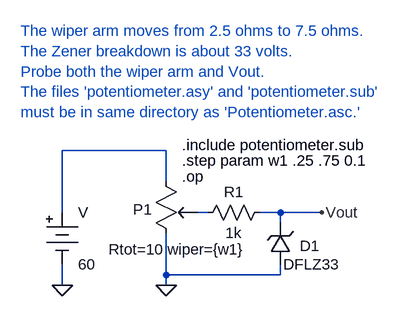
[diagram p0: schematic Zener.asc]
Zener.asc, the LTspice schematic file:
Version 4
SHEET 1 2024 848
WIRE -432 -560 -592 -560
WIRE -432 -512 -432 -560
WIRE -592 -464 -592 -560
WIRE -368 -464 -384 -464
WIRE -256 -464 -288 -464
WIRE -192 -464 -256 -464
WIRE -256 -448 -256 -464
WIRE -432 -368 -432 -432
WIRE -256 -368 -256 -384
WIRE -256 -368 -432 -368
WIRE -592 -352 -592 -384
WIRE -432 -352 -432 -368
FLAG -432 -352 0
FLAG -592 -352 0
FLAG -192 -464 Vout
SYMBOL Misc\\battery -592 -480 R0
WINDOW 123 0 0 Left 0
WINDOW 39 0 0 Left 0
SYMATTR InstName V
SYMATTR Value 60
SYMBOL potentiometer -448 -528 R0
WINDOW 3 -73 121 Left 0
WINDOW 0 -35 59 Left 0
SYMATTR Value Rtot=10 wiper={w1}
SYMATTR InstName P1
SYMBOL zener -240 -384 R180
WINDOW 0 -45 29 Left 0
WINDOW 3 -76 0 Left 0
SYMATTR InstName D1
SYMATTR Value DFLZ33
SYMBOL res -272 -480 R90
WINDOW 0 0 56 VBottom 0
WINDOW 3 32 56 VTop 0
SYMATTR InstName R1
SYMATTR Value 1k
TEXT -408 -568 Left 0 !.include potentiometer.sub
TEXT -408 -544 Left 0 !.step param w1 .25 .75 0.1
TEXT -408 -520 Left 0 !.op
TEXT -656 -744 Left 0 ;The wiper arm moves from 2.5 ohms to 7.5 ohms.\nThe Zener breakdown is about 33 volts.\nProbe both the wiper arm and Vout.\nThe files 'potentiometer.asy' and 'potentiometer.sub'\nmust be in same directory as 'Potentiometer.asc.'

The netlist it stands for:
* Zener.asc
V N001 0 60
XP1 N001 0 N002 potentiometer Rtot=10 wiper={w1}  ; pins A B C
D1 0 Vout DFLZ33
R1 Vout N002 1k
.model D D
.lib standard.dio
.include potentiometer.sub
.step param w1 .25 .75 0.1
.op
* The wiper arm moves from 2.5 ohms to 7.5 ohms.
* The Zener breakdown is about 33 volts.
* Probe both the wiper arm and Vout.
* The files 'potentiometer.asy' and 'potentiometer.sub'
* must be in same directory as 'Potentiometer.asc.'
.backanno
.end